# EAGLE design Motors Board (EAGLE 6.5.0)
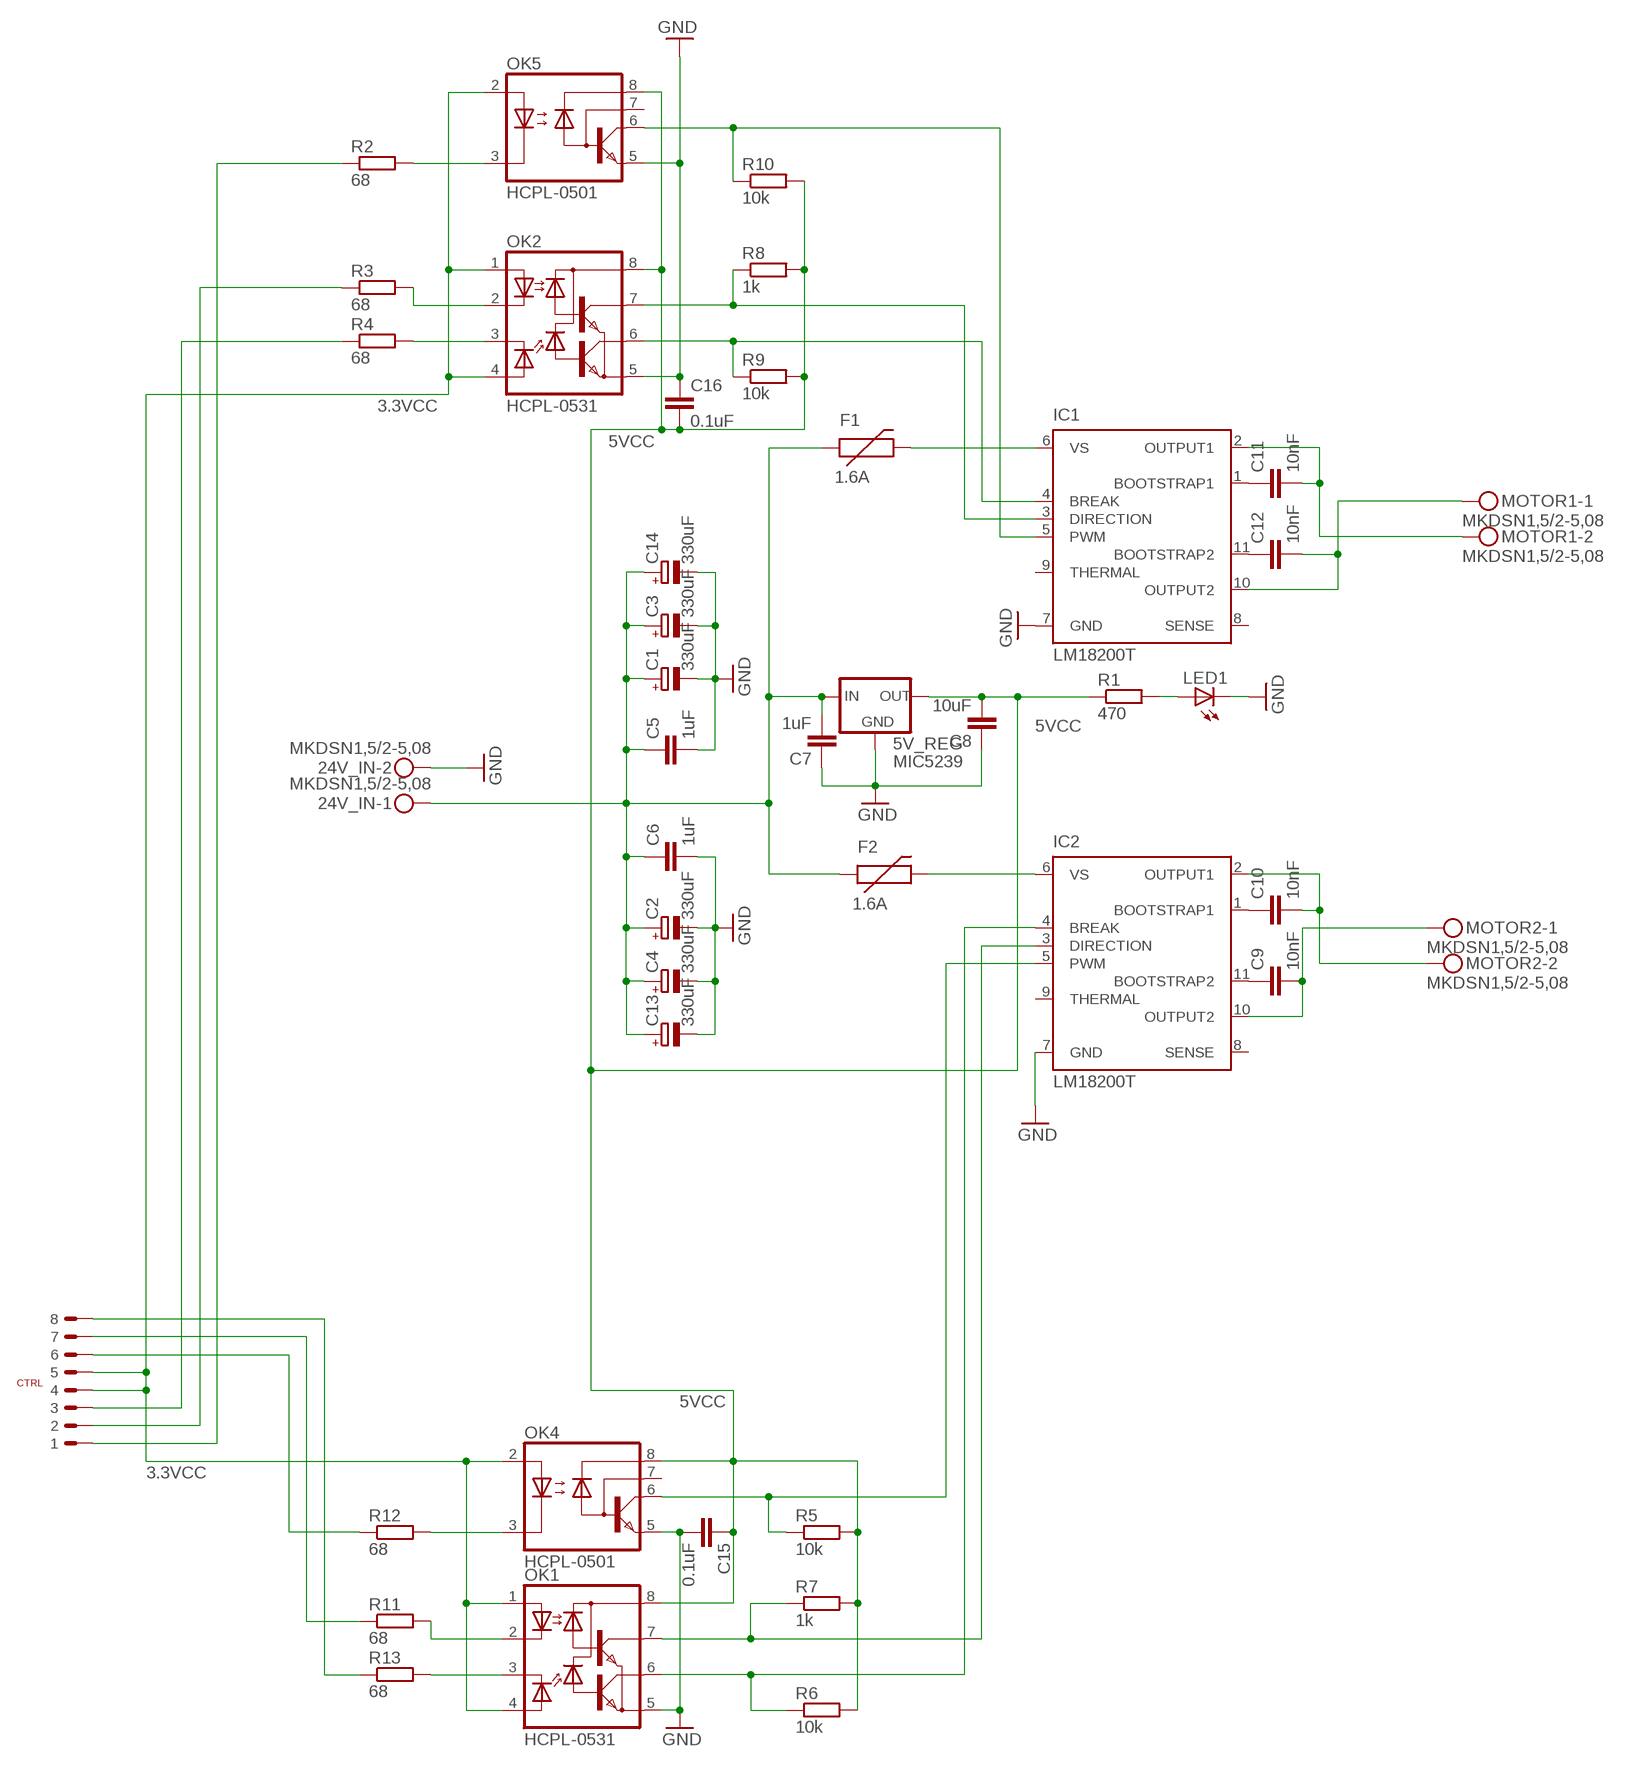
[diagram p0: schematic, sheet 1]

## Parts
5V_REG  MIC5239  [SOT223]
24V_IN  MKDSN1,5/2-5,08  [MKDSN1,5/2-5,08]
C1  330uF  CPOL-EUE5-10.5  [E5-10,5]
C2  330uF  CPOL-EUE5-10.5  [E5-10,5]
C3  330uF  CPOL-EUE5-10.5  [E5-10,5]
C4  330uF  CPOL-EUE5-10.5  [E5-10,5]
C5  1uF  C-EUC1206  [C1206]
C6  1uF  C-EUC1206  [C1206]
C7  1uF  C-EUC0805  [C0805]
C8  10uF  C-EUC0805  [C0805]
C9  10nF  C-EUC0603  [C0603]
C10  10nF  C-EUC0603  [C0603]
C11  10nF  C-EUC0603  [C0603]
C12  10nF  C-EUC0603  [C0603]
C13  330uF  CPOL-EUE5-10.5  [E5-10,5]
C14  330uF  CPOL-EUE5-10.5  [E5-10,5]
C15  0.1uF  C-EUC0603  [C0603]
C16  0.1uF  C-EUC0603  [C0603]
CTRL  87437-0843  [87437-0843]
F1  1.6A  PTCPTH  [PTC]
F2  1.6A  PTCPTH  [PTC]
IC1  LM18200T  [TO-220-11]
IC2  LM18200T  [TO-220-11]
LED1  LEDCHIP-LED0603  [CHIP-LED0603]
MOTOR1  MKDSN1,5/2-5,08  [MKDSN1,5/2-5,08]
MOTOR2  MKDSN1,5/2-5,08  [MKDSN1,5/2-5,08]
OK1  HCPL-0531  [SOIC8]
OK2  HCPL-0531  [SOIC8]
OK4  HCPL-0501  HCPL0500  [SOIC08]
OK5  HCPL-0501  HCPL0500  [SOIC08]
R1  470  R-EU_R0603  [R0603]
R2  68  R-EU_R0603  [R0603]
R3  68  R-EU_R0603  [R0603]
R4  68  R-EU_R0603  [R0603]
R5  10k  R-EU_R0603  [R0603]
R6  10k  R-EU_R0603  [R0603]
R7  1k  R-EU_R0603  [R0603]
R8  1k  R-EU_R0603  [R0603]
R9  10k  R-EU_R0603  [R0603]
R10  10k  R-EU_R0603  [R0603]
R11  68  R-EU_R0603  [R0603]
R12  68  R-EU_R0603  [R0603]
R13  68  R-EU_R0603  [R0603]

## Nets
3.3VCC: CTRL.P$4 CTRL.P$5 OK1.1(A1) OK1.4(A2) OK2.1(A1) OK2.4(A2) OK4.2(A) OK5.2(A)
5VCC: 5V_REG.3(OUT) C8.2 C15.1 C16.2 OK1.8(VCC) OK2.8(VCC) OK4.8(VCC) OK5.8(VCC) R1.1 R5.2 R6.2 R7.2 R8.2 R9.2 R10.2
24VIN: 5V_REG.1(IN) 24V_IN.1 C1.+ C2.+ C3.+ C4.+ C5.1 C6.1 C7.2 C13.+ C14.+ F1.P$1 F2.P$1
BREAK1: IC1.4(BREAK) OK2.6(VO2) R9.1
BREAK1_: CTRL.P$3 R4.1
BREAK2: IC2.4(BREAK) OK1.6(VO2) R6.1
BREAK2_: CTRL.P$8 R13.1
DIR1: IC1.3(DIRECTION) OK2.7(VO1) R8.1
DIR1_: CTRL.P$2 R3.1
DIR2: IC2.3(DIRECTION) OK1.7(VO1) R7.1
DIR2_: CTRL.P$7 R11.1
GND: 5V_REG.2(GND) 5V_REG.4(GND) 24V_IN.2 C1.- C2.- C3.- C4.- C5.2 C6.2 C7.1 C8.1 C13.- C14.- C15.2 C16.1 IC1.7(GND) IC2.7(GND) LED1.C OK1.5(GND) OK2.5(GND) OK4.5(GND) OK5.5(GND)
N$1: C11.1 IC1.1(BOOTSTRAP1)
N$2: C12.2 IC1.10(OUTPUT2) MOTOR1.1
N$3: C11.2 IC1.2(OUTPUT1) MOTOR1.2
N$4: C9.2 IC2.10(OUTPUT2) MOTOR2.1
N$6: LED1.A R1.2
N$7: C10.2 IC2.2(OUTPUT1) MOTOR2.2
N$9: OK5.3(C) R2.2
N$12: OK2.2(C1) R3.2
N$13: OK2.3(C2) R4.2
N$20: OK1.3(C2) R13.2
N$21: OK1.2(C1) R11.2
N$22: F1.P$2 IC1.6(VS)
N$26: OK4.3(C) R12.2
N$27: C12.1 IC1.11(BOOTSTRAP2)
N$28: C9.1 IC2.11(BOOTSTRAP2)
N$29: C10.1 IC2.1(BOOTSTRAP1)
N$32: F2.P$2 IC2.6(VS)
PWM1: IC1.5(PWM) OK5.6(VO) R10.1
PWM1_: CTRL.P$1 R2.1
PWM2: IC2.5(PWM) OK4.6(VO) R5.1
PWM2_: CTRL.P$6 R12.1
Unconnected: IC1.8(SENSE) IC1.9(THERMAL) IC2.8(SENSE) IC2.9(THERMAL) OK4.7(VB) OK5.7(VB)

## Library data of the parts
5V_REG = v-reg:MIC5239
24V_IN MOTOR1 MOTOR2 = con-phoenix-508:MKDSN1,5/2-5,08: MKDSN 1,5/ 2-5,08 Printklemme Nennstrom: 13,5 A Nennspannung: 250 V Rastermaß: 5,08 mm Polzahl: 2 Anschlussart: Schraubanschluss Montage: Löten Anschlussrichtung Leiter/Platine: 0 ° Artikelnummer: 1729128 Source: http://eshop.phoenixcontact.com .. 1729128.pdf; MPN: MKDSN 1,5/2-5.08; OC_FARNELL: 1792903; OC_NEWARK: 30M2397
C1-C4 C13 C14 = rcl:CPOL-EU: POLARIZED CAPACITOR, European symbol
C5-C12 C15 C16 = rcl:C-EU: CAPACITOR, European symbol
CTRL = custom:87437-0843
F1 F2 = SparkFun:PTC: Resettable Fuse PTC Resettable Fuse. Spark Fun Electronics SKU : COM-08357
IC1 IC2 = national-semiconductor:LM18200T: 3A, 55V H-Bridge Motor Control SourcE: http://cache.national.com/ds/LM/LMD18200.pdf; OC_FARNELL: unknown; OC_NEWARK: unknown
LED1 = led:LED: LED OSRAM: - CHIPLED LG R971, LG N971, LY N971, LG Q971, LY Q971, LO R971, LY R971 LH N974, LH R974 LS Q976, LO Q976, LY Q976 LO Q996 - Hyper CHIPLED LW Q18S LB Q993, LB Q99A, LB R99A - SideLED LS A670, LO A670, LY A670, LG A670, LP A670 LB A673, LV A673, LT A673, LW A673 LH A674 LY A675 LS A676, LA A676, LO A676, LY A676, LW A676 LS A679, LY A679, LG A679 - Hyper Micro SIDELED® LS Y876, LA Y876, LO Y876, LY Y876 LT Y87S - SmartLED LW L88C, LW L88S LB L89C, LB L89S, LG L890 LS L89K, LO L89K, LY L89K LS L896, LA L896, LO L896, LY L896 - TOPLED LS T670, LO T670, LY T670, LG T670, LP T670 LSG T670, LSP T670, LSY T670, LOP T670, LYG T670 LG T671, LOG T671, LSG T671 LB T673, LV T673, LT T673, LW T673 LH T674 LS T676, LA T676, LO T676, LY T676, LB T676, LH T676, LSB T676, LW T676 LB T67C, LV T67C, LT T67C, LS T67K, LO T67K, LY T67K, LW E67C LS E67B, LA E67B, LO E67B, LY E67B, LB E67C, LV E67C, LT E67C LW T67C LS T679, LY T679, LG T679 LS T770, LO T770, LY T770, LG T770, LP T770 LB T773, LV T773, LT T773, LW T773 LH T774 LS E675, LA E675, LY E675, LS T675 LS T776, LA T776, LO T776, LY T776, LB T776 LHGB T686 LT T68C, LB T68C - Hyper Mini TOPLED® LB M676 - Mini TOPLED Santana® LG M470 LS M47K, LO M47K, LY M47K Source: http://www.osram.convergy.de LUXEON: - LUMILED® LXK2-PW12-R00, LXK2-PW12-S00, LXK2-PW14-U00, LXK2-PW14-V00 LXK2-PM12-R00, LXK2-PM12-S00, LXK2-PM14-U00 LXK2-PE12-Q00, LXK2-PE12-R00, LXK2-PE12-S00, LXK2-PE14-T00, LXK2-PE14-U00 LXK2-PB12-K00, LXK2-PB12-L00, LXK2-PB12-M00, LXK2-PB14-N00, LXK2-PB14-P00, LXK2-PB14-Q00 LXK2-PR12-L00, LXK2-PR12-M00, LXK2-PR14-Q00, LXK2-PR14-R00 LXK2-PD12-Q00, LXK2-PD12-R00, LXK2-PD12-S00 LXK2-PH12-R00, LXK2-PH12-S00 LXK2-PL12-P00, LXK2-PL12-Q00, LXK2-PL12-R00 Source: www.luxeon.com KINGBRIGHT: KA-3528ASYC Source: www.kingbright.com
OK1 OK2 = custom:HCPL-0531
OK4 OK5 = optocoupler:HCPL0500: HEWLETT PACKARD OPTO COUPLER; MF: AGILENT TECHNOLOGIES; MPN: HCPL-0500-000E; OC_FARNELL: 9995226; OC_NEWARK: 31K6926
R1-R13 = rcl:R-EU_: RESISTOR, European symbol

## Board
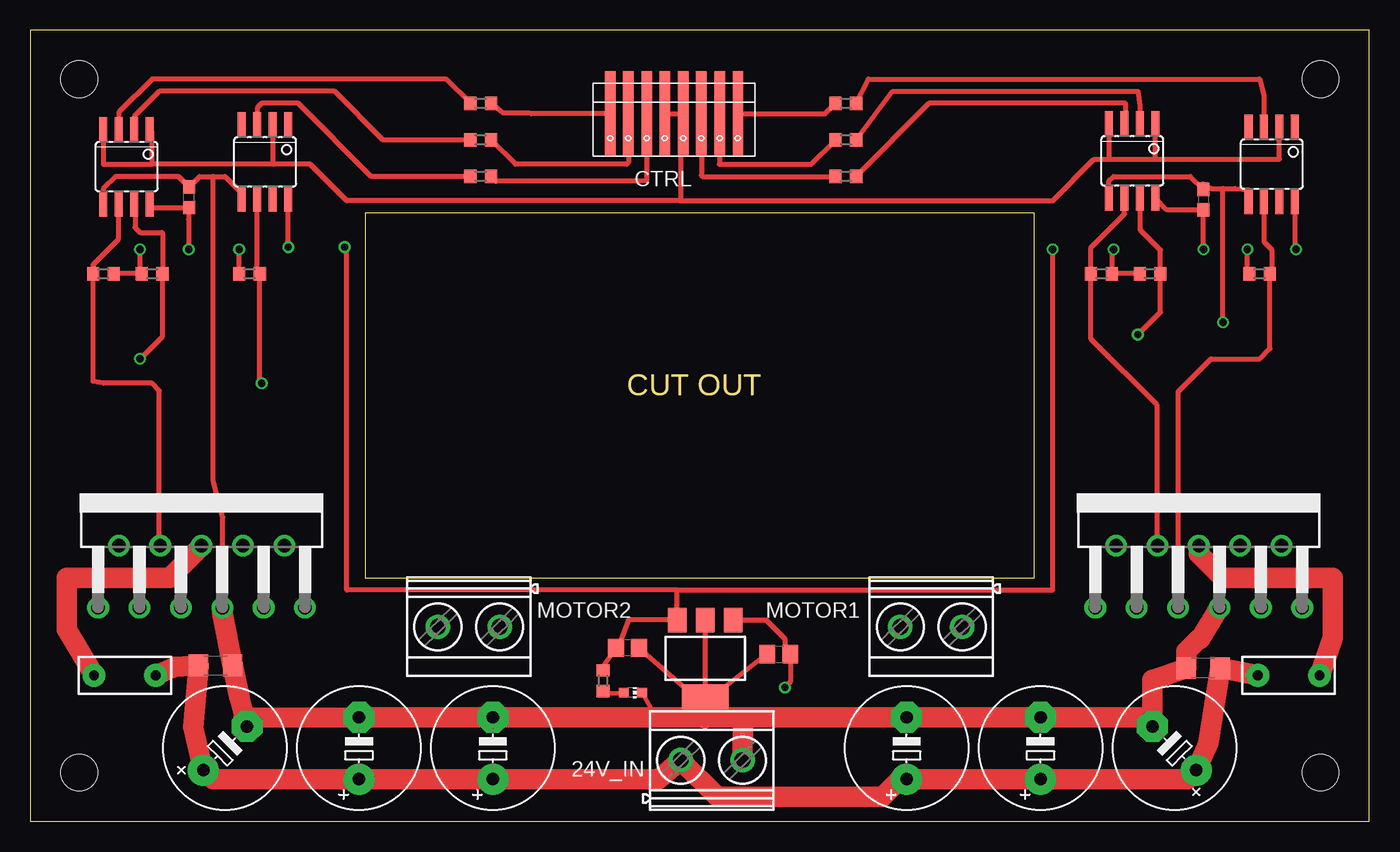
[diagram p1: board, top side]
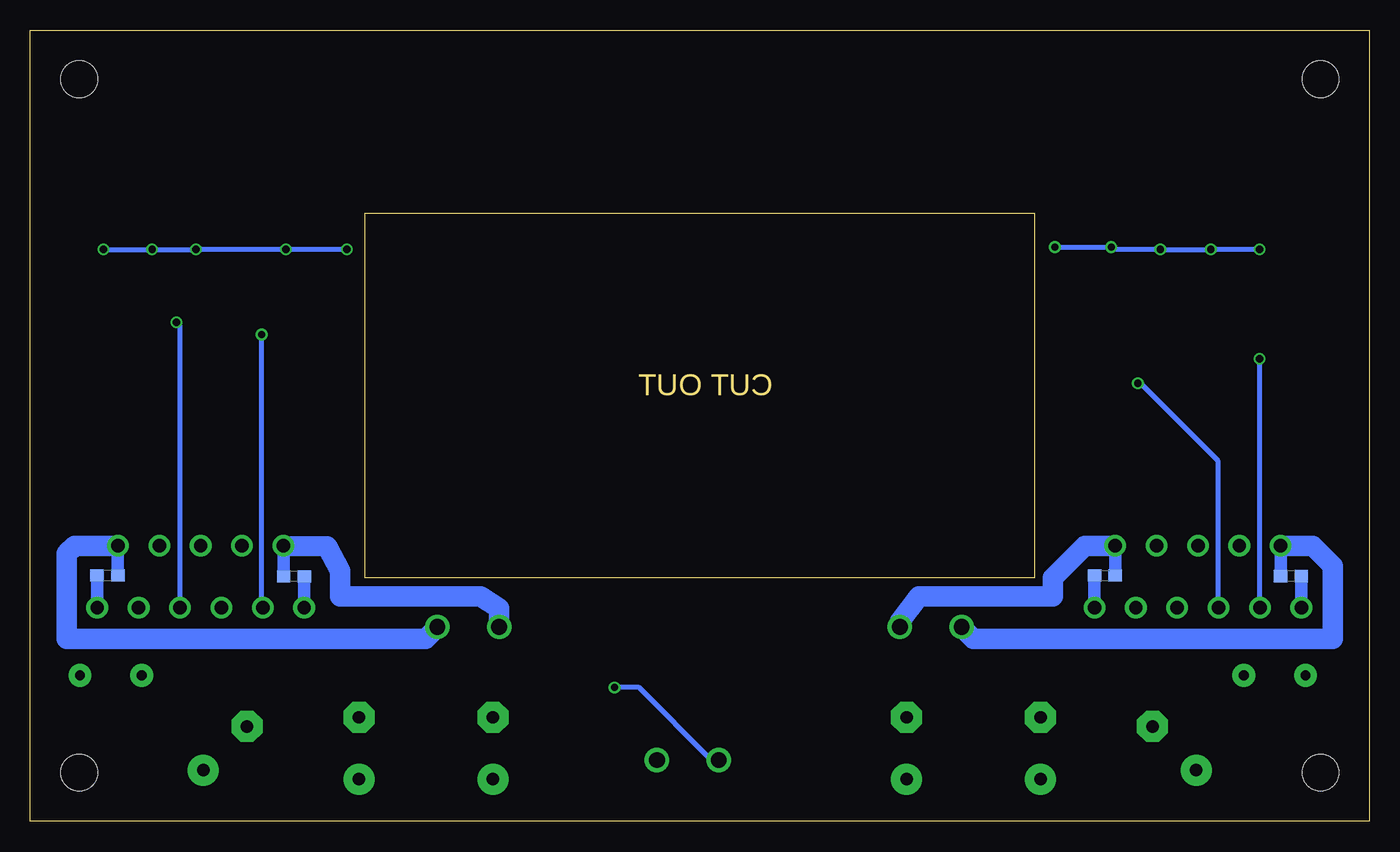
[diagram p2: board, bottom side, seen from below]

Size 110 x 65 mm. Coordinates in mm from the lower left corner, seen from the top.
Outline: 0,0 110,0 110,65 0,65 0,0
Outline: 27.5,50 27.5,20 82.5,20 82.5,50 27.5,50
Copper layers (1*16): Top 0.0356mm / dielectric 1.5011mm / Bottom 0.0356mm
Design rules "LaenPCBOrder *": minimum track width 6mil, minimum drill 13mil, track to track 16mil, track to pad 16mil, pad to pad 16mil, via to via 16mil, smd to smd 6mil, copper to edge 15mil, drill to drill 6mil, minimum pad ring 7mil, minimum via ring 7mil, stop-mask expansion 4mil, vias tented up to drill 0mil, thermal gap 10mil
Holes 3 mm at 4,61 106,61 4,4 106,4

### Footprints (pad centres in the part's own frame; a part is rotated, then mirrored left to right if it is on the bottom)
SOT223 = smd 1.5 x 2: 1 -2.3,-3.15; 2 0,-3.15; 3 2.3,-3.15 | smd 3.8 x 2: 4 0,3.15
MKDSN1,5/2-5,08 = drill 1.3 pad 2: 1 -2.561,0.025; 2 2.519,0.025
E5-10,5 = drill 1.016 pad 2.54: + -2.54,0 | drill 1.016 pad 2.54 octagon: - 2.54,0
C1206 = smd 1.6 x 1.8: 1 -1.4,0; 2 1.4,0
C0805 = smd 1.3 x 1.5: 1 -0.95,0; 2 0.95,0
C0603 = smd 1.1 x 1: 1 -0.85,0; 2 0.85,0
87437-0843 = smd 7 x 0.85: P$1 -0.04,5.27; P$2 -0.04,3.77; P$3 -0.04,2.27; P$4 -0.04,0.77; P$5 -0.04,-0.73; P$6 -0.04,-2.23; P$7 -0.04,-3.73; P$8 -0.04,-5.23
PTC = drill 0.8 pad 1.88: P$1 -2.54,0; P$2 2.54,0
TO-220-11 = drill 1.1 pad 1.778: 1 -8.5,-9.37; 2 -6.8,-4.29; 3 -5.1,-9.37; 4 -3.4,-4.29; 5 -1.7,-9.37; 6 0,-4.29; 7 1.7,-9.37; 8 3.4,-4.29; 9 5.1,-9.37; 10 6.8,-4.29; 11 8.5,-9.37
CHIP-LED0603 = smd 0.8 x 0.8: A 0,-0.75; C 0,0.75
SOIC8 = smd 0.66 x 2.032: 1 -1.445,-3.343; 2 -0.175,-3.343; 3 1.095,-3.343; 4 2.365,-3.343; 5 2.365,2.803; 6 1.095,2.803; 7 -0.175,2.803; 8 -1.445,2.803
SOIC08 = smd 0.66 x 2.032: 1 -1.905,-3.073; 2 -0.635,-3.073; 3 0.635,-3.073; 4 1.905,-3.073; 5 1.905,3.073; 6 0.635,3.073; 7 -0.635,3.073; 8 -1.905,3.073
R0603 = smd 1 x 1.1: 1 -0.85,0; 2 0.85,0

### Placement (x,y rotation side)
5V_REG  55.45,13.39 180 top
24V_IN  56,5 0 top
C1  94,6 135 top
C2  27,6 90 top
C3  72,6 90 top
C4  38,6 90 top
C5  96.37,12.59 180 top
C6  15.22,12.82 0 top
C7  61.49,13.74 0 top
C8  49.07,14.26 180 top
C9  21.71,20.2 0 bottom
C10  6.42,20.14 180 bottom
C11  88.35,20.14 180 bottom
C12  103.67,20.21 0 bottom
C13  16,6 45 top
C14  83,6 90 top
C15  13.03,51.28 90 top
C16  96.37,51.09 270 top
CTRL  52.87,58.11 270 top
F1  103.39,12 0 top
F2  7.76,12 180 top
IC1  96.01,26.93 0 top
IC2  14.07,26.93 0 top
LED1  49.5,10.57 270 top
MOTOR1  74,16 180 top
MOTOR2  36,16 180 top
OK1  8.36,53.53 180 top
OK2  91,54 180 top
OK4  19.28,54.18 180 top
OK5  102,54 180 top
R1  47.05,11.55 270 top
R2  67,59 0 top
R3  67,56 0 top
R4  67,53 0 top
R5  18,45 180 top
R6  6,45 0 top
R7  10,45 180 top
R8  92,45 180 top
R9  88,45 0 top
R10  101,45 180 top
R11  37,56 180 top
R12  37,53 180 top
R13  37,59 180 top

### Tracks (layer width: path | path; a pad name or v marks a point on that pad's centre or on a via)
3.3VCC
  Top 0.406: CTRL.P$5 CTRL.P$4 53.4,57.91 53.4,51 | 53.4,51 26,51 23,54 20,54 | 53.4,51 84,51 87.4,54.4 88.6,54.4 | 20,54 10,54 | 10,54 10,56.68 OK1.1 | OK4.2 19.92,54.08 20,54 | OK1.4 6,54 10,54 | 88.6,54.4 92.4,54.4 | 92.4,54.4 102.6,54.4 102.64,54.44 OK5.2 | OK2.4 88.6,57.31 88.6,54.4 | OK2.1 92.4,57.3 92.4,54.4
5VCC  (via drill 0.6)
  Top 0.406: R1.1 46.85,12.39 C8.2 48.4,13.94 48.4,14.6 49.14,16.54 5V_REG.3 53.15,19 | 53.15,19 26,19 26,47 v25.81,47.19 | 53.15,19 84,19 v84,47 | OK1.8 10.1,50.43 C15.1 13,49.47 v13,47 | v21.19,47.19 OK4.8 | R5.2 v17.15,47 | R6.2 R7.2 9,45.15 v9,47 | R8.2 R9.2 88.85,46.85 v89,47 | R10.2 100,45.15 v100,47 | v96.4,47 96.37,47.03 C16.2 93.4,50.24 OK2.8 | OK5.8 103.91,47 v104,47
  Bottom 0.406: v9,47 v13,47 v17.15,47 21,47 v21.19,47.19 v25.81,47.19 | v84,47 v89,47 v96.4,47 v100,47 v104,47
24VIN  (via drill 0.6)
  Top 0.406: 5V_REG.1 60.46,16.54 62,15 62,14.18 C7.2 62.44,11.44 v62,11
  Top 1.676: F2.P$1 11.89,12.7 C6.1 13.38,7.74 C13.+ 15.02,3.46 C2.+ C4.+ 51.61,3.46 24V_IN.1 56.46,2 70,2 71.46,3.46 C3.+ C14.+ 95.05,3.46 C1.+ 96.8,6.41 C5.1 98.8,12.39 F1.P$1
  Bottom 0.406: 24V_IN.1 54.02,5.03 60,11 v62,11
BREAK1
  Top 0.406: OK2.6 89.91,49.91 87.15,47.15 R9.1 87.15,39.65 92.6,34.2 IC1.4
BREAK1_
  Top 0.406: CTRL.P$3 55.14,53.06 55.2,53 R4.1
BREAK2
  Top 0.406: OK1.6 7.2,50.66 7.2,47.8 5.15,45.75 R6.1 5.15,36.15 6,36 10,36 10.6,35.4 10.6,22.7 IC2.4
BREAK2_
  Top 0.406: CTRL.P$8 41.15,58.15 41,58.2 38.85,58.2 R13.1
DIR1  (via drill 0.6)
  Top 0.406: OK2.7 91.2,51.17 91.2,48.6 92.85,46.95 R8.1 92.85,41.85 v91,40 | IC1.3 91,17.65
  Bottom 0.406: v91,40 91,17.65 IC1.3
DIR1_
  Top 0.406: CTRL.P$2 56.64,54.04 56.6,54 64.15,54 R3.1
DIR2  (via drill 0.6)
  Top 0.406: v9,38 10.85,39.85 R7.1 10.85,48.35 10.8,48.4 9,48.4 8.6,48.8 8.6,50.66 OK1.7
  Bottom 0.406: IC2.3 9,17.59 v9,38
DIR2_
  Top 0.406: CTRL.P$7 49.14,54.14 49,54 39.85,54 R11.1
GND  (via drill 0.6)
  Top 0.406: LED1.C 51,9.22 51,8.54 | 5V_REG.2 55.45,10 | C7.1 56.71,10.74 55.45,10 | C8.1 54.11,10.66 55.45,10 | OK1.5 6,51.99 7,53 12.17,53 C15.2 13.9,53 15,53 | 15,53 16,53 17.38,51.62 OK4.5 | IC2.7 15.8,17.79 15.8,25 15,28 15,53 | OK2.5 88.64,52.63 89,53 95.31,53 C16.1 96.37,52.37 97,52 98,52 | 98,52 99,52 100.09,51.91 OK5.5 | v98,41 98,52
  Top 1.676: 24V_IN.2 58.54,8.54 | 58.54,8.54 55,8.54 | 55,8.54 55.45,8.45 55.45,10 5V_REG.4 | 55,8.54 51,8.54 C4.- C2.- 17.52,8.51 C13.- 17.18,10.12 C6.2 15.77,17.17 IC2.7 | 58.54,8.54 C3.- C14.- 91.46,8.54 C1.- 92.2,11.62 C5.2 94.97,13.97 96,15 96.15,15 IC1.7
  Bottom 0.406: IC1.7 97.71,40.71 v98,41
N$1
  Bottom 1.016: IC1.1 87.51,20.12 C11.1
N$2
  Bottom 1.016: C12.2 IC1.10
  Bottom 1.676: MOTOR1.1 77.54,15 107,15 107,22 106.36,22.64 IC1.10
N$3
  Bottom 1.016: C11.2 89.19,22.63 IC1.2
  Bottom 1.676: IC1.2 85.6,22.6 84.57,20.57 84.57,18.5 73,18.5 71.48,17.48 MOTOR1.2
N$4
  Bottom 1.016: C9.2 IC2.10
  Bottom 1.676: MOTOR2.1 38.56,16.44 37,18.5 26,18.5 26,20 23.36,22.64 IC2.10
N$6
  Top 0.406: R1.2 47.08,10.5 LED1.A
N$7
  Bottom 1.016: C10.2 IC2.2
  Bottom 1.676: MOTOR2.2 32.51,15 3,15 3,21 4.64,22.64 IC2.2
N$9
  Top 0.406: R2.2 68.85,61 101,61 101.36,59.63 OK5.3
N$12
  Top 0.406: R3.2 70.85,60 91,60 91.17,58.83 OK2.2
N$13
  Top 0.406: OK2.3 90,57.44 90,59 73.85,59 R4.2
N$20
  Top 0.406: R13.2 34.15,61 10,61 7.27,58.27 OK1.3
N$21
  Top 0.406: R11.2 29,56 25,60 10.6,60 8.54,57.94 OK1.2
N$22
  Top 1.676: F1.P$2 107,15.07 107,20 98,20 96.01,21.99 IC1.6
N$26
  Top 0.406: R12.2 28,53 22,59 19,59 18.65,58.65 OK4.3
N$27
  Bottom 1.016: IC1.11 104.51,20.2 C12.1
N$28
  Bottom 1.016: IC2.11 C9.1
N$29
  Bottom 1.016: C10.1 IC2.1
N$32
  Top 1.676: F2.P$2 3,15.78 3,20 11.43,20 IC2.6
PWM1
  Top 0.406: IC1.5 94.31,35.31 97,38 101,38 101.85,38.85 R10.1 102,45.15 102,47 101.36,47.63 OK5.6
PWM1_
  Top 0.406: CTRL.P$1 65.3,58.15 R2.1
PWM2  (via drill 0.6)
  Top 0.406: v19,36 18.85,36.15 R5.1 18.65,45.2 OK4.6
  Bottom 0.406: IC2.5 12.4,17.59 12.4,29.6 18.8,36 v19,36
PWM2_
  Top 0.406: CTRL.P$6 50.64,52.64 50,52.6 38.25,52.6 R12.1

### Text on the board
Dimension: CUT OUT